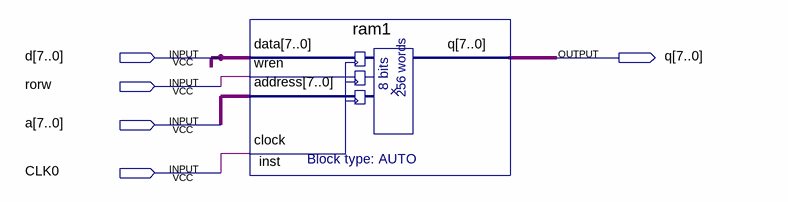
[diagram p0: schematic sheet]
// Quartus schematic exercise_RAM.bdf as structural Verilog: 1 symbols, 5 pins
module exercise_RAM (
  input  [7:0] d,
  input  rorw,
  input  [7:0] a,
  input  CLK0,
  output [7:0] q
);

  ram1 inst (.data(d), .wren(rorw), .address(a), .clock(CLK0), .q(q));
endmodule
